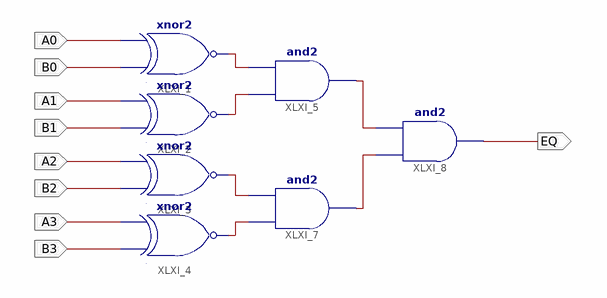
[diagram p0: schematic sheet 1]
// Xilinx ISE schematic comparator.sch (spartan3) as structural Verilog: 7 symbols, 9 ports
module comparator (
  input  A0,
  input  B0,
  input  A1,
  input  B1,
  input  A2,
  input  B2,
  input  A3,
  input  B3,
  output EQ
);

  wire XLXN_1, XLXN_2, XLXN_3, XLXN_4, XLXN_5, XLXN_6;

  xnor XLXI_1 (XLXN_1, B0, A0);
  xnor XLXI_2 (XLXN_2, B1, A1);
  xnor XLXI_3 (XLXN_3, B2, A2);
  xnor XLXI_4 (XLXN_4, B3, A3);
  and XLXI_5 (XLXN_6, XLXN_2, XLXN_1);
  and XLXI_7 (XLXN_5, XLXN_4, XLXN_3);
  and XLXI_8 (EQ, XLXN_5, XLXN_6);
endmodule
